# EAGLE design JKW_shild (EAGLE 5.10)
02: GND; 03: flasher_in; 1: 12V; 2: SPI_D; 3: SPI_CLK; 4: SPI_DC; 5: SPI_CS; 6: GND; 7: 3.3V; 8: SPI_RES; WAY2: GND; WAY3: Sig
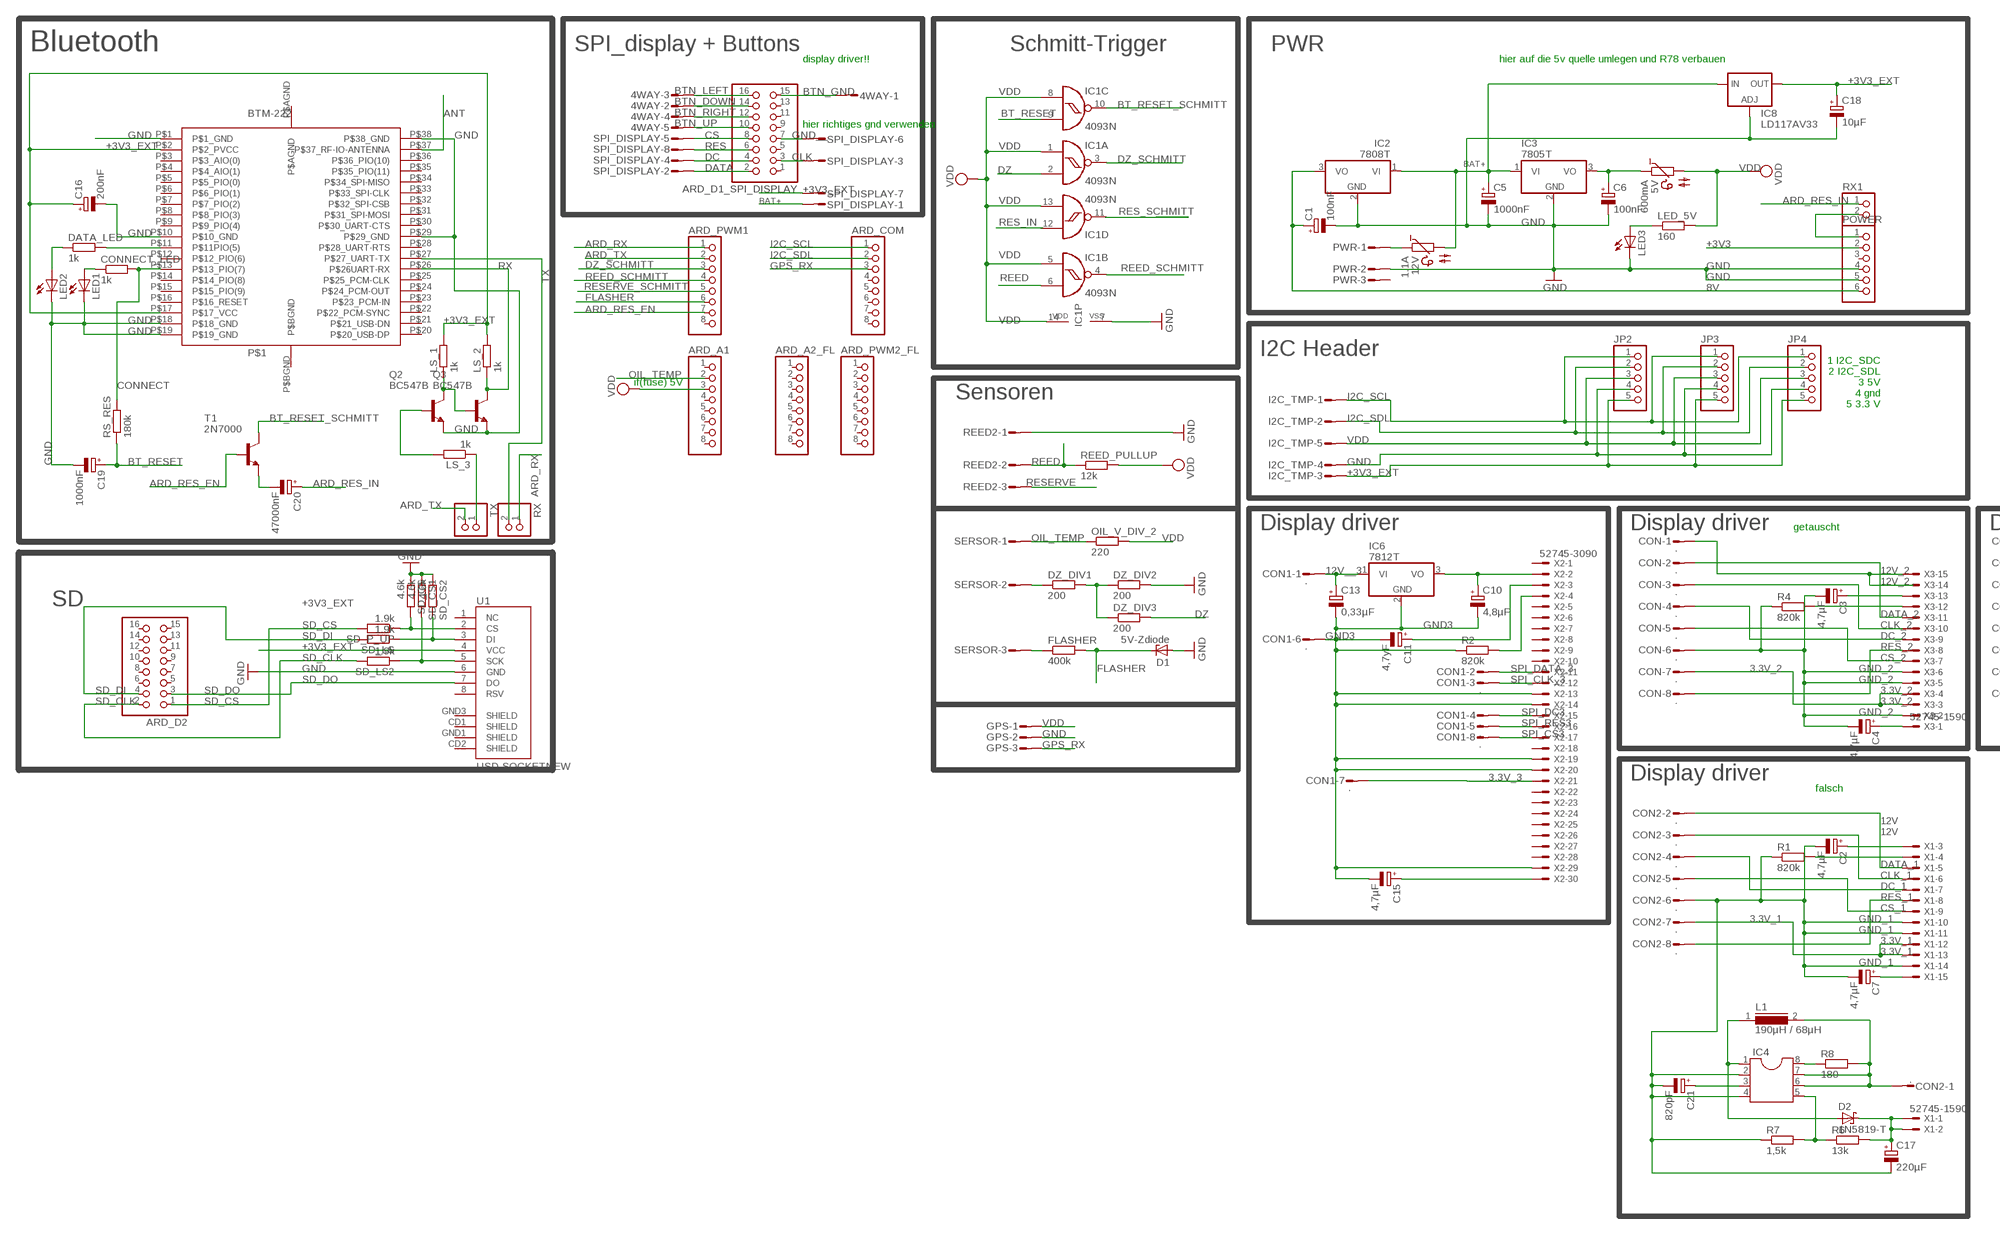
[diagram p0: schematic, sheet 1, part 1 of 2]
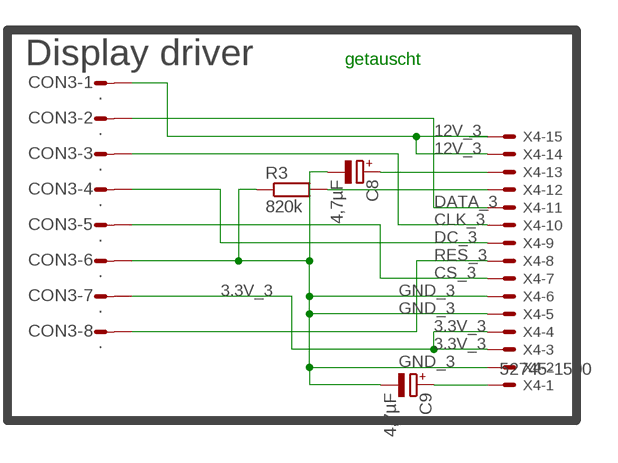
[diagram p1: schematic, sheet 1, part 2 of 2]

## Parts
4WAY  S05P  [S05P]
5V  600mA  NTC642-6  [P642]
12V  1.1A  NTC642-6  [P642]
ARD_A1  PINHD-1X8  [1X08]
ARD_A2_FL  PINHD-1X8  [1X08]
ARD_COM  PINHD-1X8  [1X08]
ARD_D1_SPI_DISPLAY  PINHD-2X8  [2X08]
ARD_D2  PINHD-2X8  [2X08]
ARD_PWM1  PINHD-1X8  [1X08]
ARD_PWM2_FL  PINHD-1X8  [1X08]
C1  100nF  CPOL-EUE2-5  [E2-5]
C2  4,7µF  CPOL-EUE2-5  [E2-5]
C3  4,7µF  CPOL-EUE2-5  [E2-5]
C4  4,7µF  CPOL-EUE2-5  [E2-5]
C5  1000nF  CPOL-EUE2-5  [E2-5]
C6  100nF  CPOL-EUE2-5  [E2-5]
C7  4,7µF  CPOL-EUE2-5  [E2-5]
C8  4,7µF  CPOL-EUE2-5  [E2-5]
C9  4,7µF  CPOL-EUE2-5  [E2-5]
C10  4,8µF  CPOL-EUE2-5  [E2-5]
C11  4,7yF  CPOL-EUE2-5  [E2-5]
C13  0,33µF  CPOL-EUE2-5  [E2-5]
C15  4,7µF  CPOL-EUE2-5  [E2-5]
C16  200nF  CPOL-EUE2-5  [E2-5]
C17  220µF  CPOL-EUE5-8.5  [E5-8,5]
C18  10µF  CPOL-EUE2-5  [E2-5]
C19  1000nF  CPOL-EUE2-5  [E2-5]
C20  47000nF  CPOL-EUE2-5  [E2-5]
C21  820pF  CPOL-EUB45181B  [B45181B]
CON  .  S08P  [S08P]
CON1  .  S08P  [S08P]
CON2  .  S08P  [S08P]
CON3  .  S08P  [S08P]
CONNECT_LED  1k  R-EU_0309/10  [0309/10]
D1  5V-Zdiode  1N821  [DO35Z10]
D2  1N5819-T  [DO41-7.6]
DATA_LED  1k  R-EU_0309/10  [0309/10]
DZ_DIV1  200  R-EU_0309/10  [0309/10]
DZ_DIV2  200  R-EU_0309/10  [0309/10]
DZ_DIV3  200  R-EU_0309/10  [0309/10]
FLASHER  400k  R-EU_0309/10  [0309/10]
GPS  S03P  [S03P]
I2C_TMP  S05P  [S05P]
IC1  4093N  [DIL14]
IC2  7808T  [TO220H]
IC3  7805T  [TO220H]
IC4  DIL8  [DIL08]
IC6  7812T  [TO220H]
IC8  LD117AV33  [TO220L1]
JP2  PINHD-1X5  [1X05]
JP3  PINHD-1X5  [1X05]
JP4  PINHD-1X5  [1X05]
L1  190µH / 68µH  SLF7045  [SLF7045]
LED1  LED3MM  [LED3MM]
LED2  LED3MM  [LED3MM]
LED3  LED3MM  [LED3MM]
LED_5V  160  R-EU_0309/10  [0309/10]
LS_1  1k  R-EU_0309/10  [0309/10]
LS_2  1k  R-EU_0309/10  [0309/10]
LS_3  1k  R-EU_0309/10  [0309/10]
OIL_V_DIV_2  220  R-EU_0309/10  [0309/10]
P$1  BTM-222  [BTM-222]
POWER  PINHD-1X6  [1X06]
PWR  S03P  [S03P]
Q2  BC547B  [TO92]
Q3  BC547B  [TO92]
R1  820k  R-EU_0309/10  [0309/10]
R2  820k  R-EU_0207/10  [0207/10]
R3  820k  R-EU_0309/10  [0309/10]
R4  820k  R-EU_0309/10  [0309/10]
R6  13k  R-EU_0309/10  [0309/10]
R7  1,5k  R-EU_0309/10  [0309/10]
R8  180  R-EU_0309/10  [0309/10]
REED2  S03P  [S03P]
REED_PULLUP  12k  R-EU_0309/10  [0309/10]
RS_RES  180k  R-EU_0309/10  [0309/10]
RX  PINHD-1X2  [1X02]
RX1  PINHD-1X2  [1X02]
SD_CS  4.6k  R-EU_0309/10  [0309/10]
SD_CS1  4.6k  R-EU_0309/10  [0309/10]
SD_CS2  4.6k  R-EU_0309/10  [0309/10]
SD_LS  1.9k  R-EU_0309/10  [0309/10]
SD_LS2  1.9k  R-EU_0309/10  [0309/10]
SD_P_UP  1.9k  R-EU_0309/10  [0309/10]
SERSOR  S03P  [S03P]
SPI_DISPLAY  S08P  [S08P]
T1  2N7000  2N3904  [TO92]
TX  PINHD-1X2  [1X02]
U1  USD-SOCKETNEW  [MICRO-SD-SOCKET-PP]
X1  52745-1590  [52745-1590]
X2  52745-3090  [52745-3090]
X3  52745-1590  [52745-1590]
X4  52745-1590  [52745-1590]

## Nets
3,3V_3: CON1.7 X2.21
3.3V_1: CON2.7 X1.12 X1.13
3.3V_2: CON.7 X3.3 X3.4
3.3V_3: CON3.7 X4.3 X4.4
8V: C1.+ IC2.3(VO) POWER.6
12V: C17.+ D2.C R6.2 X1.1 X1.2
12V_2: CON.1 X3.15
12V_3: CON3.1 X4.14 X4.15
12V__3: C13.+ CON1.1 IC6.1(VI)
+3V3: POWER.2
+3V3_EXT: C16.+ C18.+ I2C_TMP.3 IC8.2(OUT) JP2.5 JP3.5 JP4.5 LS_1.2 LS_2.2 P$1.P$2(P$2_PVCC) P$1.P$17(P$17_VCC) SPI_DISPLAY.7 U1.4(VCC)
_TX: LS_3.1 TX.1
ANT: P$1.P$37(P$37_RF-IO-ANTENNA)
ARD_RES_EN: ARD_PWM1.7 T1.2(B)
ARD_RES_IN: C20.+ RX1.1
ARD_RX: ARD_PWM1.1 RX.1
ARD_TX: ARD_PWM1.2 TX.2
BAT+: 12V.2 C5.+ IC2.1(VI) IC3.1(VI) IC8.3(IN) SPI_DISPLAY.1
BT_RESET: C19.+ IC1.9(C:I1) RS_RES.1
BT_RESET_SCHMITT: IC1.10(C:O) T1.1(C)
BTN_DOWN: 4WAY.2 ARD_D1_SPI_DISPLAY.14
BTN_GND: 4WAY.1 ARD_D1_SPI_DISPLAY.15
BTN_LEFT: 4WAY.3 ARD_D1_SPI_DISPLAY.16
BTN_RIGHT: 4WAY.4 ARD_D1_SPI_DISPLAY.12
BTN_UP: 4WAY.5 ARD_D1_SPI_DISPLAY.10
CLK: ARD_D1_SPI_DISPLAY.3 SPI_DISPLAY.3
CLK_1: CON2.3 X1.6
CLK_2: CON.3 X3.10
CLK_3: CON3.3 X4.10
CONNECT: CONNECT_LED.2 P$1.P$13(P$13_PIO(7)) RS_RES.2
CS: ARD_D1_SPI_DISPLAY.8 SPI_DISPLAY.5
CS_1: CON2.5 X1.9
CS_2: CON.5 X3.7
CS_3: CON3.5 X4.7
DATA: ARD_D1_SPI_DISPLAY.2 SPI_DISPLAY.2
DATA_1: CON2.2 X1.5
DATA_2: CON.2 X3.11
DATA_3: CON3.2 X4.11
DC: ARD_D1_SPI_DISPLAY.4 SPI_DISPLAY.4
DC_1: CON2.4 X1.7
DC_2: CON.4 X3.9
DC_3: CON3.4 X4.9
DZ: DZ_DIV3.2 IC1.2(A:I1)
DZ_SCHMITT: ARD_PWM1.3 IC1.3(A:O)
FLASHER: ARD_PWM1.6 D1.C FLASHER.2
GND: C1.- C5.- C6.- C16.- C18.- C19.- D1.A DZ_DIV2.2 GPS.2 I2C_TMP.4 IC1.7(P:VSS) IC2.2(GND) IC3.2(GND) IC8.1(ADJ) JP2.4 JP3.4 JP4.4 LED1.K(C) LED2.K(C) LED3.K(C) P$1.P$1(P$1_GND) P$1.P$10(P$10_GND) P$1.P$18(P$18_GND) P$1.P$19(P$19_GND) P$1.P$29(P$29_GND) P$1.P$38(P$38_GND) POWER.4 POWER.5 PWR.2 Q2.1(E) Q3.1(E) REED2.1 SD_CS1.1 SD_CS2.1 SD_CS.1 U1.6(GND)
GND3: C10.- C11.- C13.- C15.- CON1.6 IC6.2(GND) R2.1 X2.13 X2.14 X2.19 X2.20 X2.29
GND_1: C2.- C7.- C17.- C21.- CON2.6 IC4.2 IC4.4 R1.1 R7.1 X1.10 X1.11 X1.14
GND_2: C3.- C4.- CON.6 R4.1 X3.2 X3.5 X3.6
GND_3: C8.- C9.- CON3.6 R3.1 X4.2 X4.5 X4.6
GND__: ARD_D1_SPI_DISPLAY.7 SPI_DISPLAY.6
GPS_RX: ARD_COM.3 GPS.3
I2C_SCL: ARD_COM.1 I2C_TMP.1 JP2.1 JP3.1 JP4.1
I2C_SDL: ARD_COM.2 I2C_TMP.2 JP2.2 JP3.2 JP4.2
N$1: 12V.1 PWR.1
N$2: C2.+ X1.3
N$3: C20.- T1.3(E)
N$4: LS_3.2 Q2.2(B)
N$5: CONNECT_LED.1 LED1.A
N$8: DZ_DIV1.1 SERSOR.2
N$9: LED3.A LED_5V.1
N$10: POWER.1 RX1.2
N$11: C7.+ X1.15
N$12: DATA_LED.1 LED2.A
N$13: LS_1.1 Q2.3(C) Q3.2(B)
N$14: R1.2 X1.4
N$15: C8.+ X4.13
N$18: C3.+ X3.13
N$19: 5V.1 C6.+ IC3.3(VO)
N$21: FLASHER.1 SERSOR.3
N$23: C9.+ X4.1
N$24: R3.2 X4.12
N$26: SD_CS1.2 SD_LS2.1 U1.5(SCK)
N$27: C4.+ X3.1
N$28: SD_CS2.2 SD_LS.1 U1.3(DI)
N$29: DZ_DIV1.2 DZ_DIV2.1 DZ_DIV3.1
N$30: SD_CS.2 SD_P_UP.1 U1.2(CS)
N$31: R4.2 X3.12
N$35: CON2.1 IC4.6 IC4.7 L1.2 R8.2
N$36: IC4.5 R6.1 R7.2
N$41: C21.+ IC4.3
N$42: IC4.8 R8.1
N$44: D2.A IC4.1 L1.1
N$47: C11.+ X2.3
N$49: R2.2 X2.4
N$56: C10.+ IC6.3(VO) X2.2
N$58: C15.+ X2.30
OIL_TEMP: ARD_A1.2 OIL_V_DIV_2.1 SERSOR.1
REED: IC1.6(B:I1) REED2.2 REED_PULLUP.1
REED_SCHMITT: ARD_PWM1.4 IC1.4(B:O)
RES: ARD_D1_SPI_DISPLAY.6 SPI_DISPLAY.8
RES_1: CON2.8 X1.8
RES_2: CON.8 X3.8
RES_3: CON3.8 X4.8
RESERVE: REED2.3
RESERVE_SCHMITT: ARD_PWM1.5
RX: LS_2.1 P$1.P$26(P$26UART-RX) Q3.3(C)
SD_CLK: ARD_D2.2 SD_LS2.2
SD_CS: ARD_D2.1 SD_P_UP.2
SD_DI: ARD_D2.4 SD_LS.2
SD_DO: ARD_D2.3 U1.7(DO)
SPI_CLK_3: CON1.3 X2.12
SPI_CS3: CON1.8 X2.17
SPI_DATA_3: CON1.2 X2.11
SPI_DC3: CON1.4 X2.15
SPI_RES3: CON1.5 X2.16
TO_DATA_LED: DATA_LED.2 P$1.P$11(P$11PIO(5))
TX: P$1.P$27(P$27_UART-TX) RX.2
VDD: 5V.2 ARD_A1.3 GPS.1 I2C_TMP.5 IC1.1(A:I0) IC1.5(B:I0) IC1.8(C:I0) IC1.13(D:I1) IC1.14(P:VDD) JP2.3 JP3.3 JP4.3 LED_5V.2 OIL_V_DIV_2.2 REED_PULLUP.2
Unconnected: ARD_A1.1 ARD_A1.4 ARD_A1.5 ARD_A1.6 ARD_A1.7 ARD_A1.8 ARD_A2_FL.1 ARD_A2_FL.2 ARD_A2_FL.3 ARD_A2_FL.4 ARD_A2_FL.5 ARD_A2_FL.6 ARD_A2_FL.7 ARD_A2_FL.8 ARD_COM.4 ARD_COM.5 ARD_COM.6 ARD_COM.7 ARD_COM.8 ARD_D1_SPI_DISPLAY.1 ARD_D1_SPI_DISPLAY.5 ARD_D1_SPI_DISPLAY.9 ARD_D1_SPI_DISPLAY.11 ARD_D1_SPI_DISPLAY.13 ARD_D2.5 ARD_D2.6 ARD_D2.7 ARD_D2.8 ARD_D2.9 ARD_D2.10 ARD_D2.11 ARD_D2.12 ARD_D2.13 ARD_D2.14 ARD_D2.15 ARD_D2.16 ARD_PWM1.8 ARD_PWM2_FL.1 ARD_PWM2_FL.2 ARD_PWM2_FL.3 ARD_PWM2_FL.4 ARD_PWM2_FL.5 ARD_PWM2_FL.6 ARD_PWM2_FL.7 ARD_PWM2_FL.8 IC1.11(D:O) IC1.12(D:I0) P$1.P$3(P$3_AIO(0)) P$1.P$4(P$4_AIO(1)) P$1.P$5(P$5_PIO(0)) P$1.P$6(P$6_PIO(1)) P$1.P$7(P$7_PIO(2)) P$1.P$8(P$8_PIO(3)) P$1.P$9(P$9_PIO(4)) P$1.P$12(P$12_PIO(6)) P$1.P$14(P$14_PIO(8)) P$1.P$15(P$15_PIO(9)) P$1.P$16(P$16_RESET) P$1.P$20(P$20_USB-DP) P$1.P$21(P$21_USB-DN) P$1.P$22(P$22_PCM-SYNC) P$1.P$23(P$23_PCM-IN) P$1.P$24(P$24_PCM-OUT) P$1.P$25(P$25_PCM-CLK) P$1.P$28(P$28_UART-RTS) P$1.P$30(P$30_UART-CTS) P$1.P$31(P$31_SPI-MOSI) P$1.P$32(P$32_SPI-CSB) P$1.P$33(P$33_SPI-CLK) P$1.P$34(P$34_SPI-MISO) P$1.P$35(P$35_PIO(11)) P$1.P$36(P$36_PIO(10)) POWER.3 PWR.3 U1.1(NC) U1.8(RSV) U1.CD1(SHIELD) U1.CD2(SHIELD) U1.GND1(SHIELD) U1.GND3(SHIELD) X2.1 X2.5 X2.6 X2.7 X2.8 X2.9 X2.10 X2.18 X2.22 X2.23 X2.24 X2.25 X2.26 X2.27 X2.28 X3.14

## Notes on the sheet
- Bluetooth | SPI_display + Buttons | Schmitt-Trigger | PWR
- display driver!! | hier auf die 5v quelle umlegen und R78 verbauen
- hier richtiges gnd verwenden
- I2C Header | 1 I2C_SDC
- 2 I2C_SDL
- if(fuse) 5V | 3 5V
- 4 gnd
- Sensoren | 5 3.3 V
- Display driver | Display driver | getauscht | Display driver | getauscht
- SD
- Display driver
- falsch

## Power pins joined to a net without a drawn wire
P$AGND: P$1.P$AGND
P$BGND: P$1.P$BGND

## Library data of the parts
4WAY I2C_TMP = con-amp-mt:S05P: AMP MT CONNECTOR
5V 12V = ptc-ntc:NTC642-6: PHILIPS NTC
ARD_A1 ARD_A2_FL ARD_COM ARD_PWM1 ARD_PWM2_FL = pinhead:PINHD-1X8: PIN HEADER
ARD_D1_SPI_DISPLAY ARD_D2 = pinhead:PINHD-2X8: PIN HEADER
C1-C11 C13 C15-C21 = resistor:CPOL-EU: POLARIZED CAPACITOR, European symbol
CON CON1-CON3 SPI_DISPLAY = con-amp-mt:S08P: AMP MT CONNECTOR
CONNECT_LED DATA_LED DZ_DIV1-DZ_DIV3 FLASHER LED_5V LS_1-LS_3 OIL_V_DIV_2 R1-R4 R6-R8 REED_PULLUP RS_RES SD_CS SD_CS1 SD_CS2 SD_LS SD_LS2 SD_P_UP = resistor:R-EU_: RESISTOR, European symbol
D1 = diode:1N821: Reference DIODE temperature compensated, 6,2 V
D2 = diode:1N581*: 1.0A SCHOTTKY BARRIER RECTIFIER Source: http://www.diodes.com/datasheets/ds23001.pdf
GPS PWR REED2 SERSOR = con-amp-mt:S03P: AMP MT CONNECTOR
IC1 = 40xx:4093: Quad 2-input NAND schmitt trigger
IC2 IC3 IC6 = linear:78*: Positive VOLTAGE REGULATOR Source: http://cache.national.com/ds/LM/LM78L05.pdf http://www.fairchildsemi.com/ds/LM/LM7805.pdf
IC4 = ic-package:DIL8: Dual In Line / Socket
IC8 = v-reg:LD117A?*: Low drop fixed and adjustable positive voltage regulators 1 A Source: http://www.st.com/stonline/products/literature/ds/7194/ld1117axx.pdf
JP2-JP4 = pinhead:PINHD-1X5: PIN HEADER
L1 = inductors:SLF7045: SMD Inductors(Coils) For Power Line (Wound, Magnetic Shielded) Source: TDK, e531_slf7045.pdf
LED1-LED3 = led:LED: LED OSRAM: - CHIPLED LG R971, LG N971, LY N971, LG Q971, LY Q971, LO R971, LY R971 LH N974, LH R974 LS Q976, LO Q976, LY Q976 LO Q996 - Hyper CHIPLED LW Q18S LB Q993, LB Q99A, LB R99A - SideLED LS A670, LO A670, LY A670, LG A670, LP A670 LB A673, LV A673, LT A673, LW A673 LH A674 LY A675 LS A676, LA A676, LO A676, LY A676, LW A676 LS A679, LY A679, LG A679 - Hyper Micro SIDELED® LS Y876, LA Y876, LO Y876, LY Y876 LT Y87S - SmartLED LW L88C, LW L88S LB L89C, LB L89S, LG L890 LS L89K, LO L89K, LY L89K LS L896, LA L896, LO L896, LY L896 - TOPLED LS T670, LO T670, LY T670, LG T670, LP T670 LSG T670, LSP T670, LSY T670, LOP T670, LYG T670 LG T671, LOG T671, LSG T671 LB T673, LV T673, LT T673, LW T673 LH T674 LS T676, LA T676, LO T676, LY T676, LB T676, LH T676, LSB T676, LW T676 LB T67C, LV T67C, LT T67C, LS T67K, LO T67K, LY T67K, LW E67C LS E67B, LA E67B, LO E67B, LY E67B, LB E67C, LV E67C, LT E67C LW T67C LS T679, LY T679, LG T679 LS T770, LO T770, LY T770, LG T770, LP T770 LB T773, LV T773, LT T773, LW T773 LH T774 LS E675, LA E675, LY E675, LS T675 LS T776, LA T776, LO T776, LY T776, LB T776 LHGB T686 LT T68C, LB T68C - Hyper Mini TOPLED® LB M676 - Mini TOPLED Santana® LG M470 LS M47K, LO M47K, LY M47K Source: http://www.osram.convergy.de LUXEON: - LUMILED® LXK2-PW12-R00, LXK2-PW12-S00, LXK2-PW14-U00, LXK2-PW14-V00 LXK2-PM12-R00, LXK2-PM12-S00, LXK2-PM14-U00 LXK2-PE12-Q00, LXK2-PE12-R00, LXK2-PE12-S00, LXK2-PE14-T00, LXK2-PE14-U00 LXK2-PB12-K00, LXK2-PB12-L00, LXK2-PB12-M00, LXK2-PB14-N00, LXK2-PB14-P00, LXK2-PB14-Q00 LXK2-PR12-L00, LXK2-PR12-M00, LXK2-PR14-Q00, LXK2-PR14-R00 LXK2-PD12-Q00, LXK2-PD12-R00, LXK2-PD12-S00 LXK2-PH12-R00, LXK2-PH12-S00 LXK2-PL12-P00, LXK2-PL12-Q00, LXK2-PL12-R00 Source: www.luxeon.com KINGBRIGHT: KA-3528ASYC Source: www.kingbright.com
P$1 = btm-222:BTM-222: Rayson BTM-222 Bluetooth Modul all Pins
POWER = pinhead:PINHD-1X6: PIN HEADER
Q2 Q3 = transistor-npn:BC547*: NPN Transistor
RX RX1 TX = pinhead:PINHD-1X2: PIN HEADER
T1 = transistor:2N3904: NPN TRANSISTOR
U1 = SparkFun:USD-SOCKET: microSD Socket Push-push type uSD socket. Schematic element and footprint production proven. Spark Fun Electronics SKU : PRT-00127. tDoc lines correctly indicate media card edge positions when inserting (unlocked, locked, depressed).
X1 X3 X4 = con-molex:52745-1590: FFC/FPC-to-Board 0.50mm (.020") SMT Top Contact Right Angle, ZIF, Style Receptacle 52745 / 52435 Source: http://www.molex.com/product/ffc/52745.html
X2 = con-molex:52745-3090: FFC/FPC-to-Board 0.50mm (.020") SMT Top Contact Right Angle, ZIF, Style Receptacle 52745 / 52435 Source: http://www.molex.com/product/ffc/52745.html

## Board
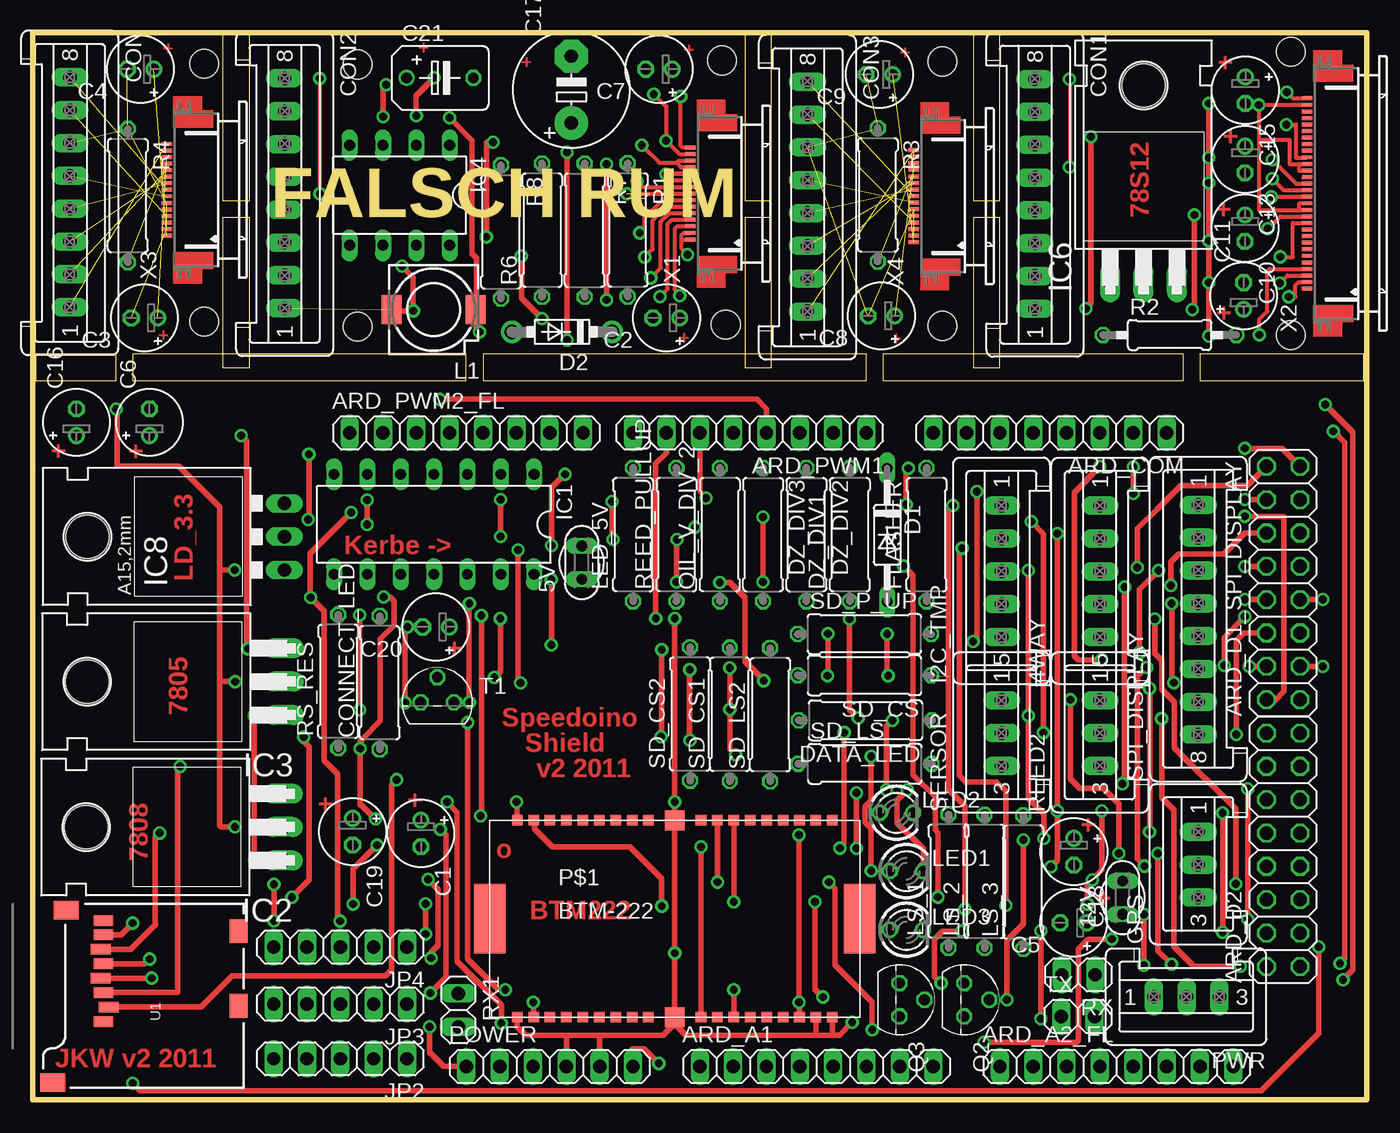
[diagram p2: board, top side]
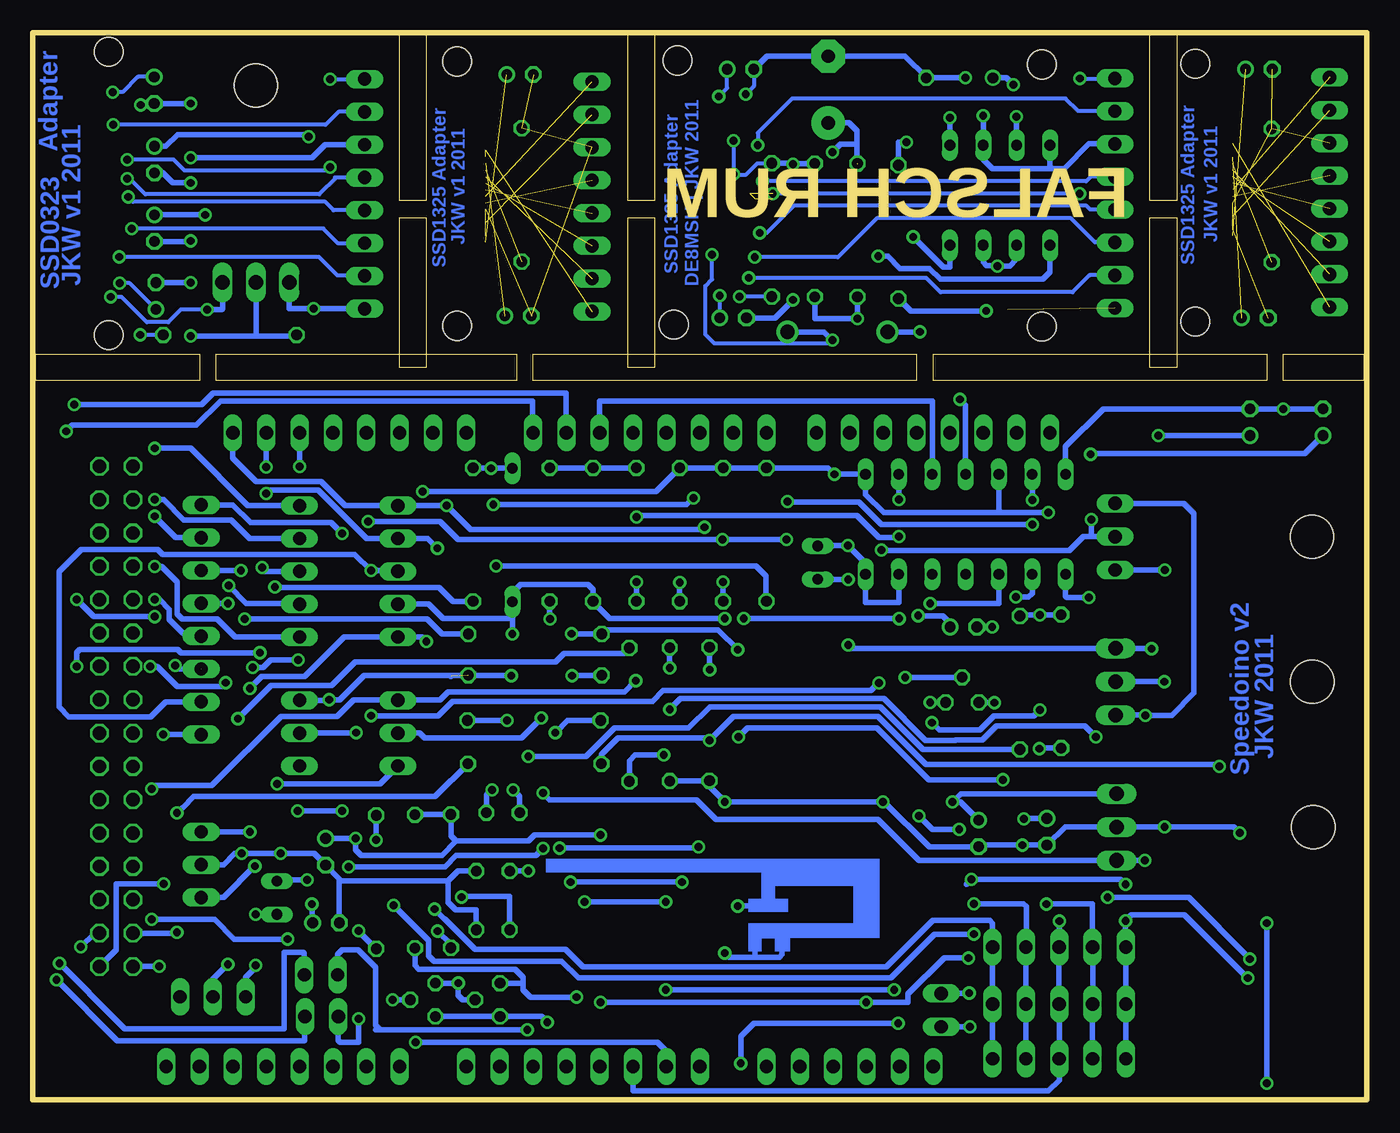
[diagram p3: board, bottom side, seen from below]

Size 101.6 x 81.28 mm. Coordinates in mm from the lower left corner, seen from the top.
Outline: 0,0 0,81.28 101.6,81.28 101.6,0 0,0
Copper layers (1*16): Top 0.035mm / dielectric 1.5mm / Bottom 0.035mm
Design rules "ZWILLING *": minimum track width 0.2mm, minimum drill 0.5mm, track to track 0.195mm, track to pad 0.195mm, pad to pad 0.2mm, via to via 0.2mm, smd to smd 0mil, copper to edge 0.2mm, drill to drill 0.2mm, minimum pad ring 0.2mm, minimum via ring 0.2mm, stop-mask expansion 0.1mm, vias tented up to drill 0mil, thermal gap 10mil
Holes 2.2 mm at 52.78,59.05 69.29,58.95 52.5,79.17 24.74,78.87 24.74,58.9 13.06,59.28 13.06,78.92 69.29,79.1 95.81,79.83 95.81,58.24

### Footprints (pad centres in the part's own frame; a part is rotated, then mirrored left to right if it is on the bottom)
S05P = drill 1.016 long: 1 5,0; 2 2.5,0; 3 0,0; 4 -2.5,0; 5 -5,0
P642 = drill 0.813 long: 1 -1.27,0; 2 1.27,0
1X08 = drill 1.016 long: 1 -8.89,0; 2 -6.35,0; 3 -3.81,0; 4 -1.27,0; 5 1.27,0; 6 3.81,0; 7 6.35,0; 8 8.89,0
2X08 = drill 1.016 octagon: 1 -8.89,-1.27; 2 -8.89,1.27; 3 -6.35,-1.27; 4 -6.35,1.27; 5 -3.81,-1.27; 6 -3.81,1.27; 7 -1.27,-1.27; 8 -1.27,1.27; 9 1.27,-1.27; 10 1.27,1.27; 11 3.81,-1.27; 12 3.81,1.27; 13 6.35,-1.27; 14 6.35,1.27; 15 8.89,-1.27; 16 8.89,1.27
E2-5 = drill 0.813 pad 1.27 round: + -1.016,0 | drill 0.813 pad 1.27 octagon: - 1.016,0
E5-8,5 = drill 1.016 pad 2.54 round: + -2.54,0 | drill 1.016 pad 2.54 octagon: - 2.54,0
B45181B = drill 0.813 round: + -2.54,0 | drill 0.813 octagon: - 2.54,0
S08P = drill 1.016 long: 1 8.75,0; 2 6.25,0; 3 3.75,0; 4 1.25,0; 5 -1.25,0; 6 -3.75,0; 7 -6.25,0; 8 -8.75,0
0309/10 = drill 0.813 octagon: 1 -5.08,0; 2 5.08,0
DO35Z10 = drill 0.813 long: A 5.08,0; C -5.08,0
DO41-7.6 = drill 1.1 pad 1.7 round: A 3.81,0; C -3.81,0
S03P = drill 1.016 long: 1 2.5,0; 2 0,0; 3 -2.5,0
DIL14 = drill 0.813 long: 1 -7.62,-3.81; 2 -5.08,-3.81; 3 -2.54,-3.81; 4 0,-3.81; 5 2.54,-3.81; 6 5.08,-3.81; 7 7.62,-3.81; 8 7.62,3.81; 9 5.08,3.81; 10 2.54,3.81; 11 0,3.81; 12 -2.54,3.81; 13 -5.08,3.81; 14 -7.62,3.81
TO220H = drill 1.118 long: 1 -2.54,-10.16; 2 0,-10.16; 3 2.54,-10.16 | hole 3.302: 0,4.826
DIL08 = drill 0.813 long: 1 -3.81,-3.81; 2 -1.27,-3.81; 3 1.27,-3.81; 4 3.81,-3.81; 5 3.81,3.81; 6 1.27,3.81; 7 -1.27,3.81; 8 -3.81,3.81
TO220L1 = drill 1.016 long: 1 -2.54,-3.81; 2 0,-3.81; 3 2.54,-3.81 | hole 3.302: 0,11.176
1X05 = drill 1.016 long: 1 -5.08,0; 2 -2.54,0; 3 0,0; 4 2.54,0; 5 5.08,0
SLF7045 = smd 1.5 x 2.2: 1 -3.2,0; 2 3.2,0
LED3MM = drill 0.813 octagon: A -1.27,0; K 1.27,0
BTM-222 = smd 0.8 x 0.8: P$1 -12.635,-7.5; P$2 -11.385,-7.5; P$3 -10.135,-7.5; P$4 -8.885,-7.5; P$5 -7.635,-7.5; P$6 -6.385,-7.5; P$7 -5.135,-7.5; P$8 -3.885,-7.5; P$9 -2.635,-7.5; P$11 1.365,-7.5; P$12 2.615,-7.5; P$13 3.865,-7.5; P$14 5.115,-7.5; P$15 6.365,-7.5; P$16 7.615,-7.5; P$17 8.865,-7.5; P$18 10.115,-7.5; P$19 11.365,-7.5; P$20 11.365,7.5; P$21 10.115,7.5; P$22 8.865,7.5; P$23 7.615,7.5; P$24 6.365,7.5; P$25 5.115,7.5; P$26 3.865,7.5; P$27 2.615,7.5; P$28 1.365,7.5; P$30 -2.635,7.5; P$31 -3.885,7.5; P$32 -5.135,7.5; P$33 -6.385,7.5; P$34 -7.635,7.5; P$35 -8.885,7.5; P$36 -10.135,7.5; P$37 -11.385,7.5; P$38 -12.635,7.5 | smd 1.5 x 1.5: P$10 -0.635,-7.5; P$29 -0.635,7.5 | smd 2.4 x 5.3: P$AGND -14.735,0; P$BGND 13.465,0
1X06 = drill 1.016 long: 1 -6.35,0; 2 -3.81,0; 3 -1.27,0; 4 1.27,0; 5 3.81,0; 6 6.35,0
TO92 = drill 0.813 octagon: 1 1.27,0; 2 0,1.905; 3 -1.27,0
0207/10 = drill 0.813 octagon: 1 -5.08,0; 2 5.08,0
1X02 = drill 1.016 long: 1 -1.27,0; 2 1.27,0
MICRO-SD-SOCKET-PP = smd 0.8 x 1.5: 1 -8.94,10.7; 2 -7.84,10.3; 3 -6.74,10.7; 4 -5.64,10.9; 5 -4.54,10.7; 6 -3.44,10.9; 7 -2.34,10.7; 8 -1.24,10.7 | smd 1.8 x 1.4: CD1 -2.05,0.4; CD2 -7.75,0.4 | smd 1.4 x 1.9: GND1 -13.6,14.55; GND3 -0.45,13.55
52745-1590 = smd 0.3 x 0.8: 1 -3.5,2.5; 2 -3,2.5; 3 -2.5,2.5; 4 -2,2.5; 5 -1.5,2.5; 6 -1,2.5; 7 -0.5,2.5; 8 0,2.5; 9 0.5,2.5; 10 1,2.5; 11 1.5,2.5; 12 2,2.5; 13 2.5,2.5; 14 3,2.5; 15 3.5,2.5
52745-3090 = smd 0.3 x 0.8: 1 -7.25,2.5; 2 -6.75,2.5; 3 -6.25,2.5; 4 -5.75,2.5; 5 -5.25,2.5; 6 -4.75,2.5; 7 -4.25,2.5; 8 -3.75,2.5; 9 -3.25,2.5; 10 -2.75,2.5; 11 -2.25,2.5; 12 -1.75,2.5; 13 -1.25,2.5; 14 -0.75,2.5; 15 -0.25,2.5; 16 0.25,2.5; 17 0.75,2.5; 18 1.25,2.5; 19 1.75,2.5; 20 2.25,2.5; 21 2.75,2.5; 22 3.25,2.5; 23 3.75,2.5; 24 4.25,2.5; 25 4.75,2.5; 26 5.25,2.5; 27 5.75,2.5; 28 6.25,2.5; 29 6.75,2.5; 30 7.25,2.5

### Placement (x,y rotation side)
4WAY  81.28,40.26 90 top
5V  41.81,40.92 90 top
12V  83.01,15.39 90 top
ARD_A1  59.69,2.54 0 top
ARD_A2_FL  82.55,2.54 0 top
ARD_COM  77.47,50.8 180 top
ARD_D1_SPI_DISPLAY  95.25,39.37 90 top
ARD_D2  95.25,19.05 90 top
ARD_PWM1  54.61,50.8 180 top
ARD_PWM2_FL  33.02,50.8 0 top
C1  29.57,20.29 270 top
C2  48.26,59.56 180 top
C3  8.51,59.56 180 top
C4  8.2,78.51 180 top
C5  79.27,13.49 180 top
C6  8.89,51.61 90 top
C7  47.7,78.51 180 top
C8  64.64,59.72 180 top
C9  64.49,78.11 180 top
C10  92.33,66.4 270 top
C11  92.23,61.24 90 top
C13  92.33,71.63 270 top
C15  92.35,76.91 270 top
C16  3.33,51.61 90 top
C17  41.02,76.96 90 top
C18  79.3,18.9 270 top
C19  24.36,20.42 270 top
C20  30.71,36.02 180 top
C21  31.01,77.85 0 top
CON  2.82,69.14 270 top
CON1  76.33,69.01 270 top
CON2  19.18,69.06 270 top
CON3  59,68.81 270 top
CONNECT_LED  26.42,31.78 90 top
D1  65.07,43.03 270 top
D2  40.31,58.5 180 top
DATA_LED  63.42,28.91 180 top
DZ_DIV1  62.23,43.05 90 top
DZ_DIV2  58.93,43.05 270 top
DZ_DIV3  55.63,43.05 270 top
FLASHER  68.07,43.05 90 top
GPS  88.77,17.91 90 top
I2C_TMP  73.79,40.26 90 top
IC1  30.56,43.84 180 top
IC2  8.89,20.78 90 top
IC3  8.97,31.85 90 top
IC4  27.94,68.91 180 top
IC6  84.61,72.44 0 top
IC8  15.34,42.9 90 top
JP2  23.42,3.12 180 top
JP3  23.42,7.29 180 top
JP4  23.42,11.63 180 top
L1  30.53,60.2 180 top
LED1  66.55,17.42 0 top
LED2  65.79,21.87 0 top
LED3  66.55,12.95 0 top
LED_5V  45.72,43.05 90 top
LS_1  69.75,16.66 90 top
LS_2  72.49,16.64 90 top
LS_3  75.44,16.59 90 top
OIL_V_DIV_2  52.32,43.05 90 top
P$1  49.53,13.79 0 top
POWER  39.37,2.54 0 top
PWR  87.88,7.85 180 top
Q2  70.94,7.62 270 top
Q3  66.01,7.62 270 top
R1  45.31,66.27 270 top
R2  86.59,58.27 0 top
R3  64.36,68.94 270 top
R4  7.24,68.88 270 top
R6  38.79,66.24 90 top
R7  42.04,66.24 270 top
R8  35.66,66.12 270 top
REED2  81.28,27.94 90 top
REED_PULLUP  49.02,43.05 90 top
RS_RES  23.27,31.88 90 top
RX  79.65,9.53 180 top
RX1  32.41,6.83 270 top
SD_CS  63.35,32.33 180 top
SD_CS1  53.09,29.36 90 top
SD_CS2  50.06,29.39 90 top
SD_LS  63.37,25.6 0 top
SD_LS2  56.16,29.34 90 top
SD_P_UP  63.35,35.48 0 top
SERSOR  73.79,27.94 90 top
SPI_DISPLAY  88.77,36.58 90 top
T1  30.81,30.28 0 top
TX  79.6,6.35 0 top
U1  16.08,14.91 90 top
X1  52.58,69.04 90 top
X2  99.54,69.04 90 top
X3  12.7,69.32 90 top
X4  69.6,68.83 90 top

### Tracks (layer width: path | path; a pad name or v marks a point on that pad's centre or on a via)
3,3V_3  (via drill 0.6)
  Top 0.305: X2.21 96.22,71.79 96.22,74.3 95.48,74.3 v95.48,74.27
  Bottom 0.305: v95.48,74.27 79.3,74.27 78.31,75.26 CON1.7
3.3V_1  (via drill 0.6)
  Top 0.305: X1.13 49.19,71.54 49.02,71.37 | X1.12 49.36,71.04 49.02,71.37 | 49.02,71.37 47.73,71.37 v46.38,72.72
  Bottom 0.305: v46.38,72.72 46.38,73.66 43.76,76.28 22.94,76.28 21.97,75.31 CON2.7
3.3V_2  (2 unrouted)
3.3V_3  (2 unrouted)
8V  (via drill 0.6)
  Top 0.406: POWER.6 45.72,3.86 45.7,3.89 46.56,3.89 v47.68,2.77 | v31.55,22.68 32.33,21.89 32.33,10.57 35.69,7.21 v35.69,5.84
  Bottom 0.406: v47.68,2.77 47.68,4.85 46.69,5.84 v35.69,5.84 | C1.+ 30.94,22.68 v31.55,22.68 30.91,23.32 IC2.3
12V  (via drill 0.6)  (1 unrouted)
  Top 0.305: 49.43,65.54 X1.1 | 49.43,65.54 49.43,65.53 49.43,64.85 | 49.43,64.85 49.71,64.57 | 49.43,65.54 49.43,65.89 49.58,66.04 X1.2 | 49.43,64.85 49.43,64.82 v49.86,64.39
  Top 0.406: v40.69,57.86 v40.69,72.19
  Bottom 0.305: v40.69,57.86 40.84,57.71 40.87,57.71 40.97,57.61 49.68,57.61 50.37,58.29 50.37,62 49.86,62.51 v49.86,64.39
  Bottom 0.406: 38.81,72.8 38.81,71.35 | 38.81,72.8 38.81,73.81 39.42,74.42 C17.+ | 38.81,72.8 40.08,72.8 v40.69,72.19 | D2.C 41.33,58.5 v40.69,57.86
12V_2  (1 unrouted)
12V_3  (2 unrouted)
12V__3  (via drill 0.6)
  Top 0.406: v80.59,73.38 80.59,60.64 v80.21,60.26
  Bottom 0.406: IC6.1 82.07,60.26 v80.21,60.26 CON1.1 | C13.+ 91.47,72.64 90.58,73.53 80.75,73.53 v80.59,73.38
+3V3_EXT  (via drill 0.6)
  Top 0.406: P$1.P$17 58.4,7.37 v58.34,7.42 v58.34,20.17 | P$1.P$2 38.15,7.4 v38.12,7.42 | v77.01,19.91 77.01,21.77 75.82,22.96 75.84,22.99 v75.84,29.26 v75.84,40.31 | v21.03,49.17 21.03,44.25 v20.98,44.2 | v30.33,10.79 30.33,11.23 30.86,11.76 30.86,16.03 v30.1,16.79 | v18.36,13.64 v18.36,16.41 | v36.96,41.88 36.96,31.95 v37.16,31.75 | U1.4 v9.07,9.27
  Bottom 0.406: I2C_TMP.3 73.84,40.31 v75.84,40.31 77.09,41.55 91.69,41.55 92.08,41.94 97.92,41.94 99.59,40.26 99.59,29.92 98.86,29.18 92.61,29.18 91.47,30.33 SPI_DISPLAY.7 | 20.9,42.9 IC8.2 | C16.+ 4.7,49.23 20.98,49.23 v21.03,49.17 | v58.34,7.42 v38.12,7.42 34.92,7.42 34.92,8.08 32.18,10.82 30.35,10.82 v30.33,10.79 | LS_2.2 72.47,21.74 LS_1.2 69.75,20.12 69.34,19.71 | C18.+ v77.01,19.91 77.01,19.02 76.61,18.62 70.43,18.62 69.34,19.71 | v58.34,20.17 63.37,20.17 63.83,19.71 69.34,19.71 | v20.98,44.2 20.98,42.98 20.9,42.9 | 20.9,42.9 21.59,42.9 22.63,41.86 36.93,41.86 v36.96,41.88 | JP2.5 JP3.5 18.34,10.95 | 18.34,10.95 JP4.5 | 18.34,10.95 18.36,10.97 v18.36,13.64 17.91,14.1 13.89,14.1 v9.07,9.27 | v18.36,16.41 18.39,16.41 18.77,16.79 v30.1,16.79 30.49,16.4 | v37.16,31.75 37.19,31.75 37.77,31.17 53.59,31.17 54.41,30.35 69.62,30.35 70.71,29.26 v75.84,29.26
_TX  (via drill 0.6)
  Top 0.406: v76.78,6.17 v76.78,12.88
  Bottom 0.406: TX.1 78.33,4.52 78.21,4.39 76.78,4.39 v76.78,6.17 | v76.78,12.88 76.78,12.85 LS_3.1
ARD_RES_EN  (via drill 0.6)
  Top 0.406: ARD_PWM1.7 48.26,49.28 47.45,48.46 v47.45,36.68 | v35.61,36.65 35.61,32.64 v35.15,32.18
  Bottom 0.406: T1.2 v35.15,32.18 | v47.45,36.68 35.64,36.68 v35.61,36.65
ARD_RES_IN  (via drill 0.6)
  Top 0.406: v31.04,20.6 31.47,20.17 31.47,9.32 v30.28,8.13 | v34.16,36.88 34.16,21.67 v34.11,21.61
  Bottom 0.406: v31.04,20.6 33.1,20.6 v34.11,21.61 | v30.28,8.13 32.41,8.13 RX1.1 | v34.16,36.88 34.14,36.85 32.28,36.85 31.8,36.37 31.73,36.37 C20.+
ARD_RX  (via drill 0.6)
  Top 0.406: v99.06,50.93 99.08,50.93 99.95,50.06 99.95,10.77 v99.57,10.39
  Bottom 0.406: ARD_PWM1.1 63.55,50.85 63.55,53.24 87.3,53.24 89.15,51.38 98.6,51.38 v99.06,50.93 | v99.57,10.39 95.07,5.87 94.61,5.41 82.47,5.41 82.47,11.25 81.03,11.25 | 80.92,11.15 80.92,11.18 81,11.25 81.03,11.25 | 80.92,11.15 81.03,11.25 | RX.1 80.92,11.15
ARD_TX  (via drill 0.6)
  Top 0.406: v99.8,9.14 100.56,9.91 100.56,50.85 v98.45,52.96
  Bottom 0.406: ARD_PWM1.2 60.98,50.83 60.98,53.85 87.86,53.85 88.75,52.96 v98.45,52.96 | TX.2 80.9,5.92 80.9,4.52 80.92,4.5 95.17,4.5 v99.8,9.14
BAT+  (via drill 0.6)
  Top 0.406: v16.87,29.29 16.87,18.26 v16.89,18.24 | v78.03,43.13 v78.03,22 78.03,18.24 v77.55,17.75 | v81.43,22 81.43,17.5 v80.7,16.76 80.34,16.41 v80.34,14.91 | v62.74,23.37 v62.74,19.15
  Bottom 0.406: IC3.1 16.89,29.31 v16.87,29.29 14.86,29.29 13.16,30.99 13.16,44.65 13.95,45.44 IC8.3 | v16.89,18.24 IC2.1 34.09,18.24 37.21,21.36 49.55,21.36 51.05,22.86 62.23,22.86 v62.74,23.37 | 12V.2 82.91,16.76 v80.7,16.76 | SPI_DISPLAY.1 86.37,45.33 85.01,43.97 78.87,43.97 | 78.87,43.97 78.87,43.99 | v78.03,43.13 78.87,43.97 | v78.03,22 v81.43,22 | v80.34,14.91 80.34,13.54 C5.+ | v77.55,17.75 70.21,17.75 69.34,18.62 63.27,18.62 v62.74,19.15
BT_RESET  (via drill 0.6)
  Top 0.406: v26.72,38.3 27.2,38.3 27.51,38 27.51,36.14 26.47,35.1 26.47,28.85 25.12,27.51 25.12,27.48 24.94,27.3 v24.94,26.75 24.94,22.53 | 24.94,22.53 24.94,22.45 | v26.11,21.41 26.06,21.41 24.94,22.53
  Bottom 0.406: IC1.9 25.48,38.58 25.76,38.3 v26.72,38.3 | C19.+ 26.09,21.44 v26.11,21.41 | RS_RES.1 24.89,26.8 v24.94,26.75
BT_RESET_SCHMITT  (via drill 0.6)
  Top 0.406: v33.25,30.28 v33.25,37.8
  Bottom 0.406: T1.1 v33.25,30.28 | IC1.10 28.02,37.8 v33.25,37.8
BTN_DOWN  (via drill 0.6)
  Top 0.406: v92.33,45.72 ARD_D1_SPI_DISPLAY.14
  Bottom 0.406: 4WAY.2 81.3,42.77 85.09,42.77 86.49,44.17 90.09,44.17 91.64,45.72 v92.33,45.72
BTN_GND  (via drill 0.6)
  Top 0.406: ARD_D1_SPI_DISPLAY.15 95.17,49.61 92.35,49.61 v92.33,49.63
  Bottom 0.406: 4WAY.1 85.22,45.26 89.59,49.63 v92.33,49.63
BTN_LEFT  (via drill 0.6)
  Top 0.406: ARD_D1_SPI_DISPLAY.16 92.51,46.79 87.43,46.79 85.62,44.98 85.6,44.98 84.12,43.51 v84.12,40.54
  Bottom 0.406: v84.12,40.54 84.12,40.31 84.05,40.23 81.31,40.23 4WAY.3
BTN_RIGHT  (via drill 0.6)
  Top 0.406: ARD_D1_SPI_DISPLAY.12 92.33,43.18 90.73,41.58 87.3,41.58 86.69,40.97 v86.69,39.17
  Bottom 0.406: 4WAY.4 81.34,37.82 85.34,37.82 v86.69,39.17
BTN_UP  (via drill 0.6)
  Top 0.406: v92.33,40.64 ARD_D1_SPI_DISPLAY.10
  Bottom 0.406: 4WAY.5 86.18,35.26 87.55,36.63 90.22,36.63 90.6,37.01 90.6,39.45 91.8,40.64 v92.33,40.64
CLK  (via drill 0.6)
  Top 0.406: v98.25,33.02 ARD_D1_SPI_DISPLAY.3 | v84.3,34.06 84.3,38.89 v85.75,40.34
  Bottom 0.406: v98.25,33.02 98.25,34.09 98.04,34.29 90.55,34.29 90.3,34.04 84.33,34.04 v84.3,34.06 | v85.75,40.34 SPI_DISPLAY.3
CLK_1  (via drill 0.6)
  Top 0.305: X1.6 48.28,68.04 47.22,66.98 47.22,64.8 v46.61,64.19
  Bottom 0.305: v46.61,64.19 40.28,64.19 37.31,67.16 22.53,67.16 20.7,65.33 19.19,65.33 CON2.3
CLK_2  (1 unrouted)
CLK_3  (1 unrouted)
CONNECT  (via drill 0.6)
  Top 0.406: P$1.P$13 v53.4,8.38 v53.39,8.38 | v35.99,8.38 35.48,8.38 33.12,10.74 v33.12,28.73 | v24.89,29.69 v24.89,36.93
  Bottom 0.406: RS_RES.2 23.29,36.93 v24.89,36.93 26.34,36.93 CONNECT_LED.2 | v35.99,8.38 v53.39,8.38 | v24.89,29.69 25.35,29.23 28.4,29.23 29.46,28.17 32.56,28.17 v33.12,28.73
CS  (via drill 0.6)
  Top 0.406: v92.33,38.1 ARD_D1_SPI_DISPLAY.8
  Bottom 0.2: 90.17,35.56 88.9,35.56 SPI_DISPLAY.5
  Bottom 0.406: 88.8,35.36 89.97,35.36 90.17,35.56 91.21,36.6 91.21,37.36 91.95,38.1 v92.33,38.1
CS_1  (via drill 0.6)
  Top 0.305: X1.9 46.47,69.54 v46.02,69.98
  Bottom 0.305: CON2.5 21.03,70.31 21.36,69.98 v46.02,69.98
CS_2  (1 unrouted)
CS_3  (1 unrouted)
DATA  (via drill 0.6)
  Top 0.406: ARD_D1_SPI_DISPLAY.2 94.67,30.48 95.3,31.11 95.3,44.45 v92.33,44.45
  Bottom 0.406: SPI_DISPLAY.2 90.7,42.82 v92.33,44.45
DATA_1  (via drill 0.6)
  Top 0.305: X1.5 48.49,67.54 47.83,66.88 47.83,63.37 v47.07,62.61
  Bottom 0.305: CON2.2 21.11,62.81 22.4,61.52 32.46,61.52 33.55,62.61 v47.07,62.61
DATA_2  (1 unrouted)
DATA_3  (1 unrouted)
DC  (via drill 0.6)
  Top 0.406: v92.66,33.02 ARD_D1_SPI_DISPLAY.4 | v86.92,31.77 86.74,31.95 v86.74,37.82
  Bottom 0.406: SPI_DISPLAY.4 v86.75,37.83 v86.74,37.82 | v92.66,33.02 92.13,33.02 90.6,31.5 87.2,31.5 v86.92,31.77
DC_1  (via drill 0.6)
  Top 0.305: X1.7 47.96,68.54 46.61,67.18 46.61,66.42 v46.23,66.04
  Bottom 0.305: v46.23,66.04 45.7,66.04 43.64,68.1 21.34,68.1 21.05,67.81 CON2.4
DC_2  (1 unrouted)
DC_3  (1 unrouted)
  Bottom 0.305: CON3.4
DZ  (via drill 0.6)
  Top 0.406: v35.64,42.9 v35.64,45.72 | 55.63,43.94 v55.63,44.4 v55.63,39.45
  Bottom 0.406: v35.64,45.72 IC1.2 | v55.63,39.45 DZ_DIV3.2 | v35.64,42.9 35.69,42.85 37.13,42.85 38.81,44.53 55.5,44.53 v55.63,44.4
DZ_SCHMITT
  Bottom 0.406: IC1.3 33.1,52.88 33.07,53.24 58.42,53.24 ARD_PWM1.3
FLASHER  (via drill 0.6)
  Top 0.406: ARD_PWM1.6 50.8,46.33 v51.28,45.85 | v66.52,45.34 66.52,47.93 v66.7,48.11
  Bottom 0.406: v51.28,45.85 51.79,45.34 v66.52,45.34 | D1.C v66.7,48.11 68.05,48.11 FLASHER.2
GND  (via drill 0.6)  (1 unrouted)
  Top 0.406: P$1.P$1 36.9,5.57 37.47,5 37.49,5 37.59,4.9 40.62,4.9 | P$1.P$19 60.91,6.28 60.91,4.98 60.96,4.93 | P$1.P$18 59.65,4.95 59.66,4.93 | 48.9,5.79 P$1.P$10 v48.9,11.18 P$1.P$29 v48.9,22.71 v48.9,36.65 | 59.66,4.93 49.76,4.93 48.9,5.79 | v6.35,52.63 6.43,52.55 6.43,48.28 11.12,48.28 14.25,45.16 14.25,40.46 | 14.25,31.95 14.25,20.9 14.35,20.8 v15.39,20.8 | 14.25,31.95 14.25,40.46 | v15.37,40.36 14.35,40.36 14.25,40.46 | v15.42,31.85 14.35,31.85 14.25,31.95 | v85.7,18.77 85.7,11.35 v86.74,10.31 | v82.73,18.77 82.73,22.53 81.53,23.72 79.76,23.72 79.02,24.46 v79.02,30.48 | P$1.P$38 36.9,22.67 v36.85,22.71 | LED1.K 67.82,19.1 65.81,21.11 65.81,22.81 v66.62,23.62 | 43.03,4.9 48.01,4.9 48.9,5.79 | 43.03,4.9 40.62,4.9 | POWER.4 40.64,4.88 40.62,4.9 | POWER.5 43.18,4.75 43.03,4.9 | 59.66,4.93 60.96,4.93 | 60.96,4.93 61.44,4.93 v62.41,5.89 | U1.6 7.47,11.48 9.32,13.34 | v24.38,14.91 24.38,17.58 v26.21,19.41 | v65.08,35.48 65.08,32.38 v65.15,32.31 | 9.32,13.34 9.35,13.36 | 9.32,13.34 9.32,19.99 v9.65,20.32
  Bottom 0.406: 73.8,37.74 I2C_TMP.4 71.44,37.76 70.33,36.65 65.38,36.65 65.08,36.96 | 19.07,31.8 IC3.2 v15.42,31.85 | GPS.2 87.07,17.91 86.21,18.77 v85.7,18.77 v82.73,18.77 80.19,18.77 C18.- 78.26,16.84 78.26,16.66 | C16.- v6.35,52.63 C6.- 20.07,52.63 22.94,49.76 IC1.7 | 46.61,10.87 46.61,11.4 | 46.61,10.87 48.59,10.87 v48.9,11.18 | 46.61,10.87 44.73,10.87 44.53,11.07 44.53,11.46 | REED2.1 79.06,30.44 v79.02,30.48 78.23,30.48 76.38,32.33 SD_CS.1 65.18,32.33 v65.15,32.31 | LED1.K 69.22,17.42 69.98,16.66 | Q2.1 Q3.1 62.87,6.35 v62.41,5.89 | PWR.2 87.88,9.17 v86.74,10.31 | v15.37,40.36 IC8.1 | v48.9,36.65 57.66,36.65 58.93,37.92 DZ_DIV2.2 58.93,38.89 59.31,39.27 64.44,39.27 65.08,38.63 D1.A 65.08,36.96 | v66.62,23.62 66.65,23.62 67.06,23.22 LED2.K | 78.26,16.66 C5.- | 78.26,16.66 69.98,16.66 | LED3.K 67.82,14.45 69.39,14.45 69.98,15.04 69.98,16.66 | JP2.4 JP3.4 20.85,8.51 20.85,10.57 20.88,10.59 JP4.4 20.88,14.91 v24.38,14.91 | SD_CS1.1 50.09,24.28 SD_CS2.1 50.06,23.88 v48.9,22.71 v36.85,22.71 36.75,22.71 33.33,19.28 C1.- 29.44,19.41 v26.21,19.41 C19.- 22.96,20.8 19.07,20.8 IC2.2 19.02,20.8 v15.39,20.8 10.13,20.8 v9.65,20.32 | 65.08,36.96 v65.08,35.48 | 69.77,32.26 69.75,32.23
GND3  (via drill 0.6)
  Top 0.305: 96.47,67.79 X2.13 | X2.14 96.47,68.29 96.47,67.79 | 96.44,71.29 95.71,71.29 95.71,73.13 93.4,73.13 | 96.44,71.29 X2.20 | X2.19 96.44,70.79 96.44,71.29 | 96.47,67.79 93.4,67.79 93.4,73.13 | 93.4,73.13 v93.4,75.79 X2.29
  Top 0.406: v89.59,58.19 v89.59,62.26 v89.59,65.43 v89.59,69.85 v89.59,71.75 v89.59,75.89
  Bottom 0.305: C15.- 93.29,75.89 v93.4,75.79
  Bottom 0.406: v89.59,62.26 C11.- | 84.48,58.19 81.58,58.19 R2.1 | 84.48,58.19 v89.59,58.19 | IC6.2 84.61,58.32 84.48,58.19 | C10.- 89.64,65.38 v89.59,65.43 | v89.59,75.89 C15.- | CON1.6 79.33,72.76 80.31,71.78 89.56,71.78 v89.59,71.75 | C13.- 91.72,70.61 90.96,69.85 v89.59,69.85
GND_1  (via drill 0.6)
  Top 0.305: X1.14 49.25,72.04 v48.23,73.05 48.23,75.67 v47.3,76.61 | X1.10 48.68,70.04 48.21,70.51 48.24,70.54 X1.11 48.26,70.54 v48.23,70.51
  Top 0.406: v29.21,74.95 29.21,76.5 v30.56,77.85 | v43.69,71.27 v43.69,60.94
  Bottom 0.305: v48.23,73.05 v48.23,70.51 48.21,70.48 47.27,70.48 46.41,71.35 R1.1 | C7.- 46.69,77.22 v47.3,76.61
  Bottom 0.406: 23.98,70.94 23.04,70.94 21.16,72.82 19.19,72.82 CON2.6 | 23.98,70.94 28.52,70.94 29.21,71.63 IC4.2 v29.21,74.95 | IC4.4 24.13,71.09 23.98,70.94 | v30.56,77.85 C21.- 33.55,77.9 35.15,79.5 C17.- 45.7,79.5 C7.- | R7.1 43.69,71.32 v43.69,71.27 43.69,71.35 R1.1 | C2.- 45.06,59.56 v43.69,60.94
GND_2  (6 unrouted)
GND_3  (6 unrouted)
GND__  (via drill 0.6)  (1 unrouted)
  Top 0.406: v98.25,38.1 ARD_D1_SPI_DISPLAY.7 | v90.75,33.1 90.75,35.23 v92.33,36.8
  Bottom 0.406: 88.78,32.82 90.47,32.82 v90.75,33.1 | v92.33,36.8 96.95,36.8 v98.25,38.1
GPS_RX  (via drill 0.6)
  Top 0.406: v81.28,48.23 79.32,46.28 79.32,33.81 79.63,33.5 v81.38,33.5 | v84.68,17.8 84.68,17.83 84.15,18.36 84.15,32.23 v84.86,32.94
  Bottom 0.406: v81.28,48.23 ARD_COM.3 | GPS.3 87.11,15.41 87.1,15.42 87.07,15.42 v84.68,17.8 | v84.86,32.94 84.05,32.94 83.49,33.5 v81.38,33.5
I2C_SCL  (via drill 0.6)
  Top 0.406: v70.08,45.26 69.72,44.91 69.72,23.65 70.99,22.38 v70.99,14.53 | 50.19,43.38 50.22,43.38 v50.44,43.61
  Bottom 0.406: ARD_COM.1 86.36,48.87 84.58,47.09 79.63,47.09 77.8,45.26 I2C_TMP.1 v70.08,45.26 | 70.05,45.26 v70.07,45.26 v70.08,45.26 | v50.44,43.61 50.62,43.43 68.25,43.43 v70.08,45.26 | v70.99,14.53 70.26,13.79 70.23,13.79 67.92,11.48 61.04,11.48 59.69,10.13 36.58,10.13 33.05,13.66 28.7,13.66 28.5,13.46 JP4.1 JP3.1 JP2.1
I2C_SDL  (via drill 0.6)
  Top 0.406: v70.79,42.01 70.56,41.78 70.56,24.71 71.04,24.23 73.41,24.23 74.12,23.52 v74.12,14.81 | v83.82,46.18 v83.82,48.21 | v29.92,14.94 v29.92,12.62
  Bottom 0.406: v83.82,48.21 ARD_COM.2 | v83.82,46.18 83.54,46.46 79.86,46.46 76.16,42.76 I2C_TMP.2 71.54,42.76 v70.79,42.01 70.56,41.78 | v74.12,14.81 71.45,12.14 71.45,10.97 71.04,10.57 61.32,10.57 60.05,9.3 36.25,9.3 32.92,12.62 v29.92,12.62 | JP2.2 JP3.2 JP4.2 25.93,11.66 25.93,14.73 26.14,14.94 v29.92,14.94
N$1  (via drill 0.6)
  Top 0.406: v84.63,10.24 v84.63,14.12
  Bottom 0.406: PWR.1 85.38,9.35 84.63,10.1 v84.63,10.24 | v84.63,14.12 12V.1
N$2  (via drill 0.6)
  Top 0.305: v49.28,61.27 49.28,61.32 48.92,61.67 48.92,66.37 49.09,66.54 X1.3
  Bottom 0.305: C2.+ v49.28,61.27
N$3  (via drill 0.6)
  Top 0.406: v28.35,30.25 28.35,35.84 v28.52,36.02
  Bottom 0.406: T1.3 28.37,30.28 v28.35,30.25 | C20.- v28.52,36.02
N$4  (via drill 0.6)
  Top 0.406: v75.44,19.79 75.44,13.41 74.19,12.17 v74.19,7.62
  Bottom 0.406: v75.44,19.79 LS_3.2 | Q2.2 v74.19,7.62
N$5  (via drill 0.6)
  Top 0.406: v63.86,26.16 63.86,22.76 63.4,22.3 63.4,21.16 63.86,20.7 v63.86,17.45
  Bottom 0.406: v63.86,26.16 59.46,26.16 57.3,28.32 51.64,28.32 50.04,29.92 37.03,29.92 33.81,26.7 CONNECT_LED.1 | LED1.A 63.88,17.42 v63.86,17.45
N$7  (via drill 0.6)
  Top 0.406: 38.2,21.29 38.2,20.65 39.57,19.28 45.49,19.28 47.9,16.87 v47.9,14.76
  Bottom 0.406: v47.9,14.76 46.63,14.76 46.63,14.73
N$8  (via drill 0.6)
  Top 0.406: v62.2,36.63 62.2,29.74 v62.87,29.08
  Bottom 0.406: DZ_DIV1.1 62.23,36.65 v62.2,36.63 | SERSOR.2 72.14,27.94 71.75,27.56 64.39,27.56 v62.87,29.08
N$9  (via drill 0.6)
  Top 0.406: v66.32,40.66 67.06,39.93 67.06,24.77 68.73,23.09 68.73,20.55 68.94,20.34 v68.94,15.44
  Bottom 0.406: v66.32,40.66 46.51,40.66 45.74,39.9 45.74,38 LED_5V.1 | LED3.A 65.28,15.47 65.3,15.49 68.89,15.49 v68.94,15.44
N$10  (via drill 0.6)
  Top 0.2: 32.84,2.54 POWER.1
  Top 0.406: 32.84,2.54 31.29,2.54 30.23,3.61 v30.23,5.56
  Bottom 0.406: v30.23,5.56 RX1.2
N$11  (via drill 0.6)
  Top 0.305: X1.15 49.48,72.54 49.33,72.69 49.33,76.4 v49.35,76.43
  Bottom 0.305: C7.+ 48.72,77.06 v49.35,76.43
N$12  (via drill 0.6)
  Top 0.406: v65.02,23.62 65.02,28.45 v65.48,28.91
  Bottom 0.406: LED2.A 64.52,23.11 v65.02,23.62 | v65.48,28.91 DATA_LED.1
N$13  (via drill 0.6)
  Top 0.406: v70.76,12.85 69.29,12.85 68.68,12.24 68.68,9.4 v69.19,8.89
  Bottom 0.406: Q2.3 v69.19,8.89 69.19,7.95 68.86,7.62 Q3.2 | LS_1.1 69.75,11.84 v70.76,12.85
N$14  (via drill 0.6)
  Top 0.305: X1.4 48.7,67.04 48.36,66.7 48.36,61.77 v47.78,61.19
  Bottom 0.305: R1.2 v47.78,61.19
N$15  (1 unrouted)
N$18  (1 unrouted)
N$19  (via drill 0.6)
  Top 0.406: v16.38,34.37 16.31,34.44 16.31,50.16 v15.88,50.6 | v39.5,34.65 v39.5,39.62
  Bottom 0.2: IC3.3 19.05,34.29 19.05,34.37
  Bottom 0.406: v39.5,39.62 41.78,39.62 5V.1 | v15.88,50.6 C6.+ | v16.38,34.37 19.05,34.37 39.22,34.37 v39.5,34.65
N$21  (via drill 0.6)
  Top 0.406: v83.16,39.06 83.16,24.26 v82.98,24.08
  Bottom 0.406: FLASHER.1 69.6,37.97 70.66,39.04 83.13,39.04 v83.16,39.06 | v82.98,24.08 75.15,24.08 SERSOR.3
N$23  (1 unrouted)
N$24  (1 unrouted)
N$26  (via drill 0.6)
  Top 0.406: U1.5 8.53,10.36 v8.89,10.72 | v20.62,27.64 20.62,27.3 21.06,26.87 21.06,16.76 19.74,15.44 v19.74,15.42 | v53.09,29.74 v53.09,32.89 | v53.09,29.74 53.11,29.72 53.11,28.91 | 53.11,28.91 53.11,26.7 v53.54,26.26 | v53.09,29.74 53.09,28.93 53.11,28.91
  Bottom 0.406: v20.62,27.64 21.46,28.47 28.19,28.47 29.26,27.41 31.29,27.41 31.32,27.38 33.6,27.38 36.78,30.56 52.27,30.56 v53.09,29.74 | v53.09,32.89 SD_CS1.2 | SD_LS2.1 56.16,25.83 55.73,26.26 v53.54,26.26 | v19.74,15.42 13.56,15.42 8.89,10.74 v8.89,10.72
N$27  (1 unrouted)
N$28  (via drill 0.6)
  Top 0.406: 5.49,8.2 5.41,8.2 U1.3 5.09,8.17 | 5.09,8.17 5.08,8.18 | 5.09,8.17 5.26,8 5.28,8 5.49,8.2 | 5.49,8.2 11.05,8.2 11.05,25.22 v11.23,25.4 | v50.04,32.77 50.04,27.41 v50.06,27.38
  Bottom 0.406: SD_LS.1 58.29,26.31 57.02,27.58 50.27,27.58 v50.06,27.38 48.23,29.21 37.24,29.21 33.58,25.55 11.38,25.55 v11.23,25.4 | SD_CS2.2 50.06,32.79 v50.04,32.77
N$29
  Bottom 0.406: DZ_DIV3.1 DZ_DIV2.1 DZ_DIV1.2
N$30  (via drill 0.6)
  Top 0.406: v60.55,35.51 60.55,32.33 v60.53,32.31 | U1.2 12.81,7.07 15.19,9.45 26.87,9.45 27.33,9.91 27.33,24 v27.71,24.38 | v47.9,34.29 47.9,27.69 v47.85,27.64
  Bottom 0.406: v60.55,35.51 60.53,35.48 SD_P_UP.1 58.22,35.48 57.91,35.79 49.4,35.79 v47.9,34.29 | v60.53,32.31 58.29,32.31 SD_CS.2 | v27.71,24.38 33.35,24.38 37.29,28.32 47.17,28.32 v47.85,27.64
N$31  (1 unrouted)
N$35  (via drill 0.6)  (1 unrouted)
  Top 0.406: v28.12,63.5 28.98,62.64 v28.98,60.1 27.43,60.1 L1.2
  Bottom 0.406: IC4.6 26.67,64.03 27.18,63.52 28.09,63.52 v28.12,63.5 28.17,63.55 28.96,63.55 29.21,63.8 IC4.7 | v28.98,60.1 34.72,60.1 R8.2
N$36  (via drill 0.6)
  Top 0.406: v37.21,64.26 37.21,61.09 v38.79,59.51
  Bottom 0.406: R7.2 42.04,59.51 v38.79,59.51 R6.1 | v37.21,64.26 36.47,64.26 35.53,63.32 33.3,63.32 32.49,62.51 24.66,62.51 24.13,63.04 IC4.5
N$41  (via drill 0.6)
  Top 0.406: v26.67,74.88 26.67,77.09 v26.9,77.32
  Bottom 0.406: IC4.3 v26.67,74.88 | C21.+ 27.43,77.85 v26.9,77.32
N$42  (via drill 0.6)
  Top 0.406: v35.05,72.95 34.54,72.95 v34.54,65.73
  Bottom 0.406: IC4.8 31.75,63.45 31.77,63.42 32.23,63.42 v34.54,65.73 | R8.1 35.66,72.95 v35.05,72.95
N$44  (via drill 0.6)
  Top 0.305: 33.81,60.27 L1.1 33.76,60.17
  Top 0.406: 33.76,60.17 33.76,58.78 v34.04,58.5 | 33.81,60.27 33.81,64.14 33.48,64.47 33.48,73.08 v31.75,74.8
  Bottom 0.406: v34.04,58.5 D2.A | v31.75,74.8 IC4.1
N$47  (via drill 0.6)
  Top 0.305: X2.3 95.55,62.79 v94.97,62.2
  Bottom 0.305: v94.97,62.2 94.21,62.2 C11.+
N$49  (via drill 0.6)
  Top 0.305: X2.4 94.2,63.29 94.03,63.12 94.03,60.07 93.42,59.46 v93.42,58.27
  Bottom 0.305: R2.2 v93.42,58.27
N$56  (via drill 0.6)
  Top 0.305: X2.2 96.4,62.29 96.16,62.05 96.16,61.16 v95.66,61.16
  Top 0.406: v88.47,67.41 88.47,60.35 v88.32,60.2
  Bottom 0.305: v88.32,60.2 90.32,60.2 91.29,59.23 92.91,59.23 94.84,61.16 v95.66,61.16
  Bottom 0.406: IC6.3 87.15,60.27 87.22,60.2 v88.32,60.2 | v88.47,67.41 C10.+
N$58  (via drill 0.6)
  Top 0.305: X2.30 95.98,76.29 v95.5,76.76
  Bottom 0.305: v95.5,76.76 94.77,76.76 93.6,77.93 C15.+
OIL_TEMP  (via drill 0.6)
  Top 0.406: v92.53,13.74 v92.53,23.67 | v82.19,12.24 80.42,12.24 79.65,11.48 79.65,4.55 79.5,4.39 v72.44,4.39 | v52.32,39.4 53.09,39.4 54.23,38.25 54.23,33.4 55.68,31.95 v55.68,31.93
  Bottom 0.406: v52.32,39.4 OIL_V_DIV_2.1 | ARD_A1.2 53.34,3.71 54.03,4.39 v72.44,4.39 | v92.53,23.67 92.25,23.95 87.96,23.95 82.7,29.21 78.41,29.21 77.17,30.45 73.8,30.45 SERSOR.1 73.77,30.45 70.59,30.45 69.98,31.06 56.54,31.06 v55.68,31.93 | v92.53,13.74 87.76,13.74 86.26,12.24 v82.19,12.24
REED  (via drill 0.6)
  Top 0.406: v44.12,45.57 44.12,42.75 v44.2,42.67 | v25.45,43.81 v25.45,45.7 | v76.99,27.96 76.99,43.1 v76.05,44.04 | v49.02,39.45 49.02,42.62 v49.07,42.67
  Bottom 0.406: IC1.6 25.48,45.72 v25.45,45.7 | v44.12,45.57 44.09,45.54 38.68,45.54 36.96,43.81 v25.45,43.81 | REED2.2 77.01,27.94 v76.99,27.96 | v76.05,44.04 70.59,44.04 69.22,42.67 v49.07,42.67 v44.2,42.67 | v49.02,39.45 REED_PULLUP.1
REED_SCHMITT  (via drill 0.6)
  Top 0.406: v30.99,53.37 55.14,53.37 55.88,52.63 ARD_PWM1.4
  Bottom 0.406: IC1.4 30.56,52.93 v30.99,53.37
RES  (via drill 0.6)
  Top 0.406: v91.67,27.84 91.67,34.98 92.25,35.56 ARD_D1_SPI_DISPLAY.6
  Bottom 0.406: v91.67,27.84 88.78,27.84 SPI_DISPLAY.8
RES_1  (via drill 0.6)  (3 unrouted)
  Top 0.305: v21.84,77.8 21.87,77.78 v21.87,69.04 | v45.24,69.04 X1.8
  Bottom 0.305: v21.84,77.8 CON2.8 | v21.87,69.04 v45.24,69.04
RES_2  (1 unrouted)
RES_3  (1 unrouted)
RX  (via drill 0.6)
  Top 0.406: v53.39,15.09 P$1.P$26 | v59.59,15.09 59.59,8.43 v60.2,7.82
  Bottom 0.406: v59.59,15.09 v53.39,15.09 | v60.2,7.82 63.7,7.82 64.26,8.38 64.26,8.87 | LS_2.1 72.49,10.26 72.21,9.96 64.87,9.96 64.26,9.35 64.26,8.87 | Q3.3 64.29,8.89 64.26,8.87
SD_CLK  (via drill 0.6)
  Top 0.406: 85.99,29.05 v85.98,29.03 85.98,23.01 86.92,22.07 86.92,11.68 88.44,10.16 v91.97,10.16
  Bottom 0.406: 93.95,10.19 ARD_D2.2 v91.97,10.16 | v85.98,29.03 83.44,31.57 78.84,31.57 77.06,33.35 61.8,33.35 61.14,34.01 56.57,34.01 SD_LS2.2
SD_CS  (via drill 0.6)
  Top 0.406: v91.62,16.46 91.62,22.15 86.94,26.82 86.94,30.3 86,31.24 86,33.48 85.47,34.01 v85.47,36.63
  Bottom 0.406: v85.47,36.63 71.58,36.63 70.43,35.48 SD_P_UP.2 | v91.62,16.46 95.25,16.46 95.25,11.43 ARD_D2.1
SD_DI  (via drill 0.6)
  Top 0.406: v90.63,21.84 v90.63,12.75
  Bottom 0.406: v90.63,21.84 90.22,22.25 90.19,22.25 89.33,23.11 70.94,23.11 SD_LS.2 | ARD_D2.4 90.68,12.7 v90.63,12.75
SD_DO  (via drill 0.6)
  Top 0.406: v97.94,11.66 97.94,5.05 93.57,0.69 8.18,0.69 v7.59,1.27 | v7.62,13.46 6.73,12.57 U1.7
  Bottom 0.406: ARD_D2.3 96.9,12.7 v97.94,11.66 | v7.62,13.46 7.62,1.29 v7.59,1.27
SPI_CLK_3  (via drill 0.6)
  Top 0.305: X2.12 95.02,67.29 94.18,66.45 94.16,66.45 v94.08,66.37
  Bottom 0.305: v94.08,66.37 79.48,66.37 78.33,65.23 76.36,65.23 CON1.3
SPI_CS3  (via drill 0.6)
  Top 0.305: X2.17 96.25,69.79 v94.41,71.63 | 78.97,77.72 v78.94,77.75 79.02,77.67 79.02,71.12 v78.94,71.04
  Bottom 0.305: v78.94,77.75 76.34,77.75 CON1.8 | v94.41,71.63 90.88,71.63 90.04,70.79 79.2,70.79 v78.94,71.04
SPI_DATA_3  (via drill 0.6)
  Top 0.305: X2.11 95.99,66.79 95.99,64.21 v95.02,64.21
  Bottom 0.305: v95.02,64.21 79.81,64.21 78.38,62.79 76.35,62.79 CON1.2
SPI_DC3  (via drill 0.6)
  Top 0.305: X2.15 94.47,68.79 v94.34,68.78
  Bottom 0.305: CON1.4 78.69,67.77 79.32,68.4 93.95,68.4 v94.34,68.78
SPI_RES3  (via drill 0.6)
  Top 0.305: X2.16 95.31,69.29 v94.41,70.18
  Bottom 0.305: 78.51,70.26 CON1.5 | 78.51,70.26 78.59,70.26 | v94.41,70.18 94.23,70.18 93.04,68.99 79.78,68.99 78.51,70.26
TO_DATA_LED  (via drill 0.6)
  Top 0.406: P$1.P$11 v50.9,19.27 | v61.8,27.96 61.8,19.51 v61.47,19.18
  Bottom 0.406: v61.47,19.18 50.99,19.18 v50.9,19.27 | DATA_LED.2 60.86,28.91 v61.8,27.96
TX  (via drill 0.6)
  Top 0.406: P$1.P$27 v52.15,16.59 | v60.63,16.59 61.11,16.1 61.11,10.29 63.93,7.47 v63.93,5.33
  Bottom 0.406: v63.93,5.33 75.13,5.33 | 75.13,5.33 75.49,5.33 | v52.15,16.59 v60.63,16.59 | RX.2 78.38,11.1 78.05,11.43 76.83,11.43 75.49,10.08 75.49,5.69 75.13,5.33
VDD  (via drill 0.6)
  Top 0.406: v39.52,42.22 39.52,46.63 v40.54,47.65 | v71.91,46.33 71.91,35.2 v71.63,34.92 | v85.06,31.34 v85.06,20.42 | v24.23,44.73 21.13,41.63 21.13,38.28 v21.16,38.25 22.17,37.24 22.17,25.86 23.22,24.82 23.22,13.82 v23.42,13.61
  Bottom 0.2: 78.79,34.34 78.74,34.29 | IC1.8 22.86,39.37 22.96,39.37
  Bottom 0.406: IC1.14 38.23,40.08 | v71.91,46.33 54.13,46.33 OIL_V_DIV_2.2 REED_PULLUP.2 LED_5V.2 41.02,48.13 v40.54,47.65 IC1.1 38.18,46.13 36.78,44.73 28.02,44.73 28.02,44.88 | IC1.14 38.18,40.89 39.5,42.22 v39.52,42.22 41.78,42.22 5V.2 | 28.02,44.88 IC1.5 | 71.96,35.26 v71.63,34.92 71.96,35.26 I2C_TMP.5 77.87,35.26 78.79,34.34 80.9,32.23 84.18,32.23 v85.06,31.34 | v85.06,20.42 88.76,20.42 GPS.1 | v24.23,44.73 27.86,44.73 28.02,44.88 | IC1.13 35.64,37.9 35.61,37.87 38.15,37.87 38.18,37.9 IC1.14 | 22.96,40.01 22.96,39.37 22.96,38.38 22.84,38.25 v21.16,38.25 | ARD_A1.3 55.88,0.69 24.23,0.69 23.42,1.5 JP2.3 JP3.3 23.44,7.32 23.44,11.61 JP4.3 v23.42,13.61
(copper drawn outside any net)
  shapes: Bottom area x9

### Text on the board
Top: + | + | + | + | + | + | 78S12 | + | + | + | + | + | + | + | + | _ | Kerbe -> | LD_3.3 | + | 7805 | Speedoino | Shield | v2 2011 | + | + | + | 7808 | o | + | BTM222 | JKW v2 2011
Bottom: Adapter | SSD1325 Adapter | DE8MSH | JKW 2011 | SSD1325 Adapter | SSD1325 Adapter | JKW v1 2011 | JKW v1 2011 | SSD0323 | JKW v1 2011 | JKW 2011 | Speedoino v2
Dimension: FALSCH RUM